# EAGLE design RDA1846 (EAGLE 7.4.0)

## Sheet 1 of 2
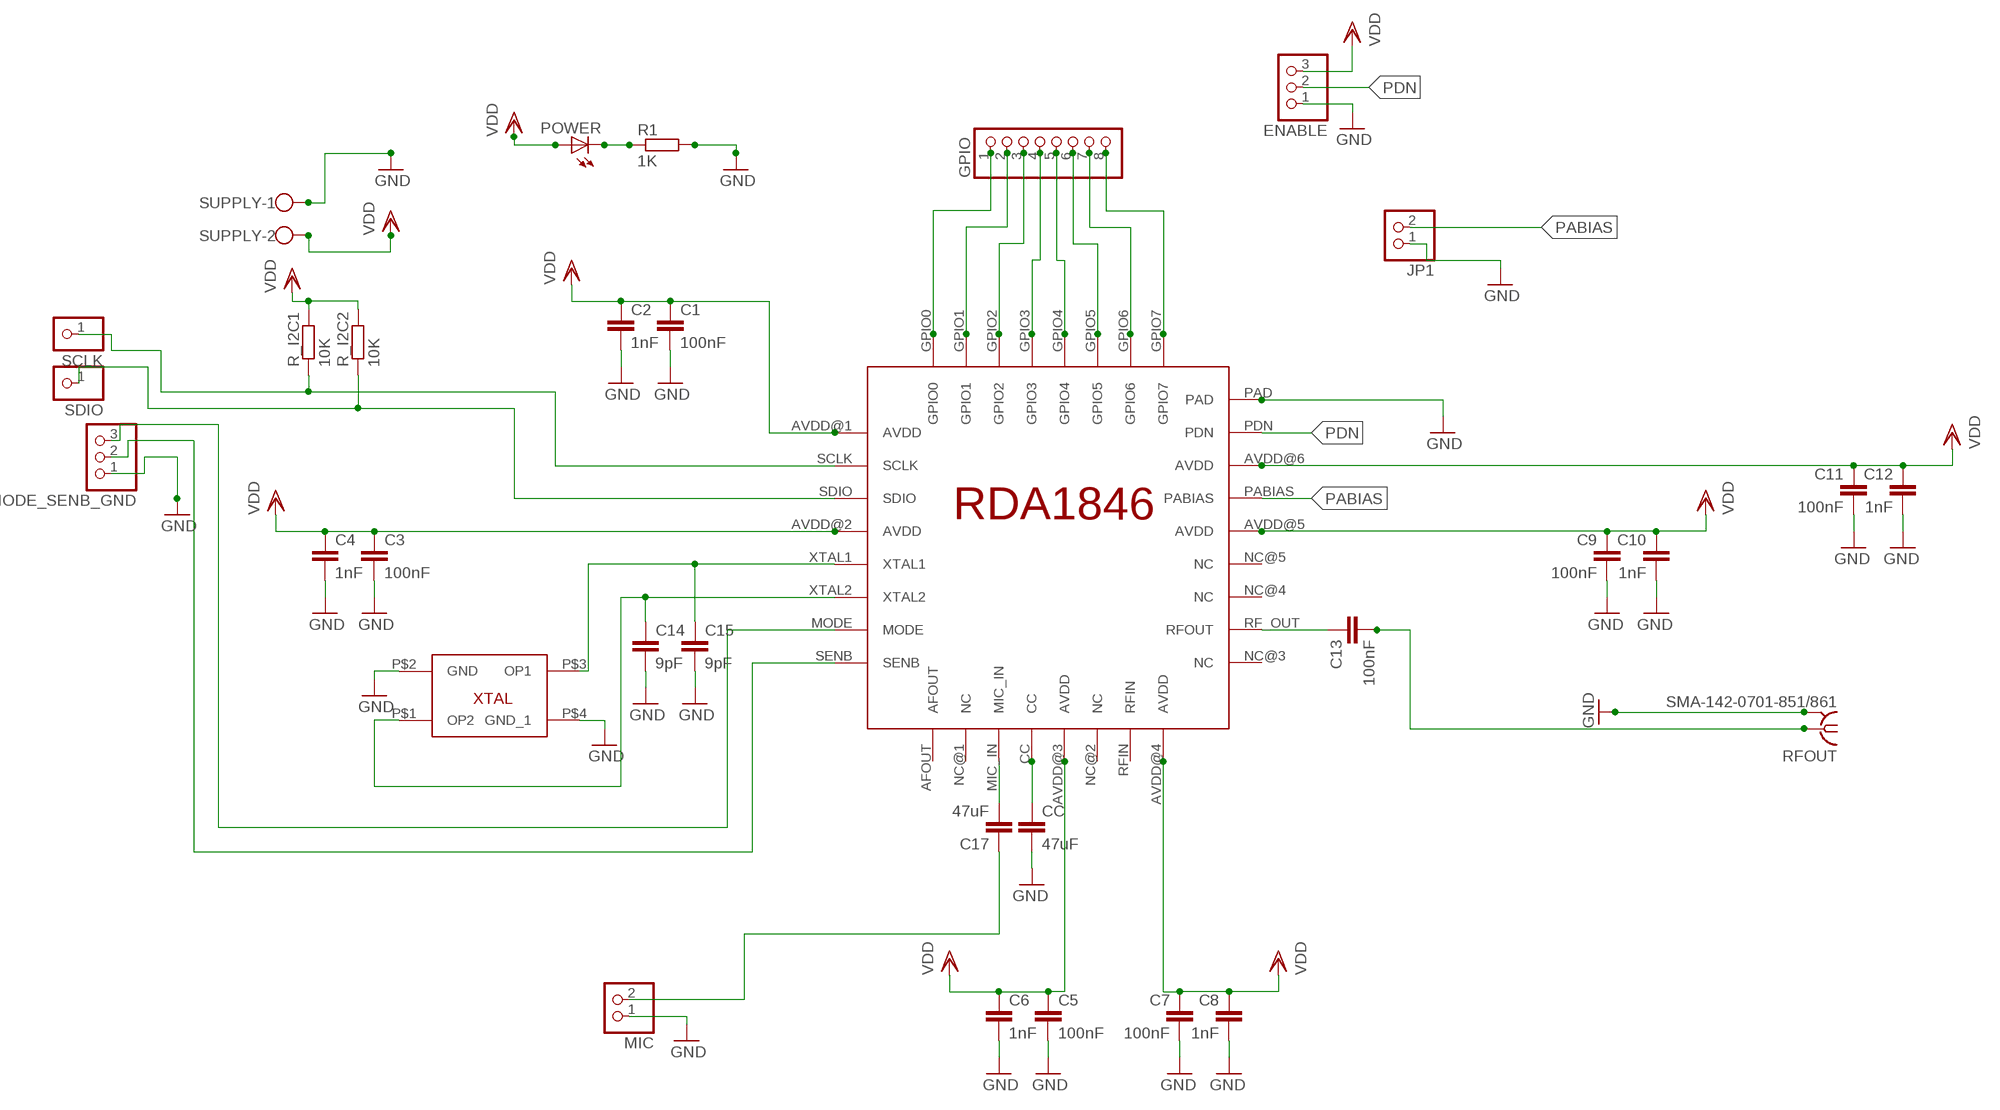
[diagram p0: schematic, sheet 1]

### Parts
C1  100nF  C-EUC0805  [C0805]
C2  1nF  C-EUC0805  [C0805]
C3  100nF  C-EUC0805  [C0805]
C4  1nF  C-EUC0805  [C0805]
C5  100nF  C-EUC0805  [C0805]
C6  1nF  C-EUC0805  [C0805]
C7  100nF  C-EUC0805  [C0805]
C8  1nF  C-EUC0805  [C0805]
C9  100nF  C-EUC0805  [C0805]
C10  1nF  C-EUC0805  [C0805]
C11  100nF  C-EUC0805  [C0805]
C12  1nF  C-EUC0805  [C0805]
C13  100nF  C-EUC0805  [C0805]
C14  9pF  C-EUC0805  [C0805]
C15  9pF  C-EUC0805  [C0805]
C17  47uF  C-EUC0805  [C0805]
CC  47uF  C-EUC0805  [C0805]
ENABLE  PINHD-1X3  [1X03]
GPIO  PINHD-1X8CLEANBIG  [1X08-CLEANBIG]
JP1  PINHD-1X2  [1X02]
MIC  PINHD-1X2  [1X02]
MODE_SENB_GND  PINHD-1X3  [1X03]
POWER  LEDCHIPLED_1206  [CHIPLED_1206]
R1  1K  R-EU_R0805  [R0805]
R_I2C1  10K  R-EU_R0805  [R0805]
R_I2C2  10K  R-EU_R0805  [R0805]
RFOUT  SMA-142-0701-851/861  [J502-ND-142-0701-851/861]
SCLK  PINHD-1X1  [1X01]
SDIO  PINHD-1X1  [1X01]
SUPPLY  W237-102  [W237-102]
U$1  RDA1846  [32_PIN_QFN]
U$2  CRYSTAL_FA_128  [FA_128]

### Nets
GND: C1.2 C2.2 C3.2 C4.2 C5.2 C6.2 C7.2 C8.2 C9.2 C10.2 C11.2 C12.2 C14.2 C15.2 CC.2 ENABLE.1 JP1.1 MIC.1 MODE_SENB_GND.1 R1.2 RFOUT.G@1 RFOUT.G@2 RFOUT.G@3 RFOUT.G@4 SUPPLY.1 U$1.PAD U$2.P$2(GND) U$2.P$4(GND_1) ; also sheet 2
MODE: MODE_SENB_GND.3 U$1.MODE
N$1: GPIO.1 U$1.GPIO0
N$2: GPIO.8 U$1.GPIO7
N$3: GPIO.2 U$1.GPIO1
N$4: GPIO.7 U$1.GPIO6
N$5: GPIO.3 U$1.GPIO2
N$6: GPIO.6 U$1.GPIO5
N$7: GPIO.4 U$1.GPIO3
N$8: GPIO.5 U$1.GPIO4
N$9: POWER.C R1.1
N$10: CC.1 U$1.CC
N$11: C13.1 U$1.RF_OUT(RFOUT)
N$12: C13.2 RFOUT.1
N$13: C15.1 U$1.XTAL1 U$2.P$3(OP1)
N$14: C14.1 U$1.XTAL2 U$2.P$1(OP2)
N$16: C17.2 U$1.MIC_IN
N$18: C17.1 MIC.2
PABIAS: JP1.2 U$1.PABIAS
PDN: ENABLE.2 U$1.PDN
SCLK: R_I2C1.1 SCLK.1 U$1.SCLK
SDIO: R_I2C2.1 SDIO.1 U$1.SDIO
SENB: MODE_SENB_GND.2 U$1.SENB
VDD: C1.1 C2.1 C3.1 C4.1 C5.1 C6.1 C7.1 C8.1 C9.1 C10.1 C11.1 C12.1 ENABLE.3 POWER.A R_I2C1.2 R_I2C2.2 SUPPLY.2 U$1.AVDD@1(AVDD) U$1.AVDD@2(AVDD) U$1.AVDD@3(AVDD) U$1.AVDD@4(AVDD) U$1.AVDD@5(AVDD) U$1.AVDD@6(AVDD)
Unconnected: U$1.AFOUT U$1.NC@1(NC) U$1.NC@2(NC) U$1.NC@3(NC) U$1.NC@4(NC) U$1.NC@5(NC) U$1.RFIN

## Sheet 2 of 2
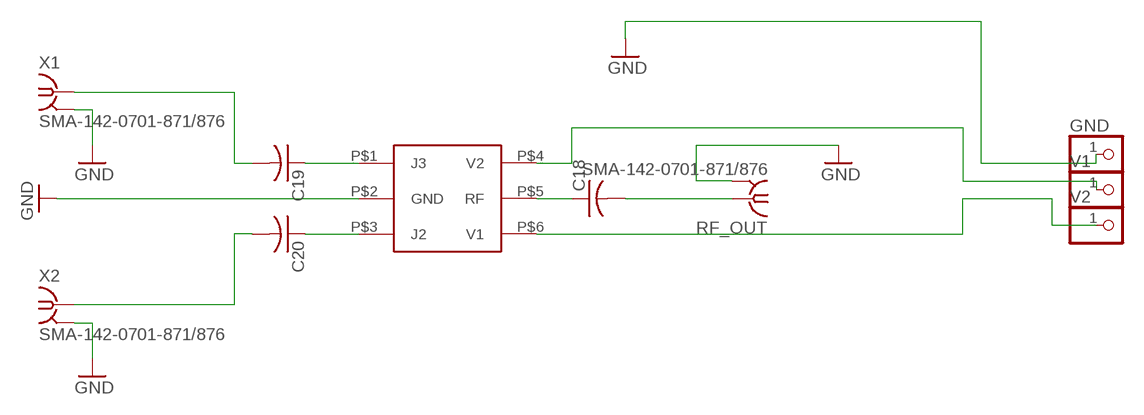
[diagram p1: schematic, sheet 2]

### Parts
C18  C-USC1206  [C1206]
C19  C-USC1206  [C1206]
C20  C-USC1206  [C1206]
GND  PINHD-1X1  [1X01]
RF_OUT  SMA-142-0701-871/876  [J502-ND-142-0701-871/876]
U$3  RF_SWITCH  [SC90]
V1  PINHD-1X1  [1X01]
V2  PINHD-1X1  [1X01]
X1  SMA-142-0701-871/876  [J502-ND-142-0701-871/876]
X2  SMA-142-0701-871/876  [J502-ND-142-0701-871/876]

### Nets
GND: GND.1 RF_OUT.G@1 RF_OUT.G@2 RF_OUT.G@3 RF_OUT.G@4 U$3.P$2(GND) X1.G@1 X1.G@2 X1.G@3 X1.G@4 X2.G@1 X2.G@2 X2.G@3 X2.G@4 ; also sheet 1
N$20: C19.2 X1.1
N$21: C19.1 U$3.P$1(J3)
N$22: C20.1 U$3.P$3(J2)
N$23: C20.2 X2.1
N$24: C18.1 U$3.P$5(RF)
N$25: C18.2 RF_OUT.1
N$26: U$3.P$4(V2) V1.1
N$27: U$3.P$6(V1) V2.1

## Library data of the parts
C1-C15 C17 CC = rcl:C-EU: CAPACITOR, European symbol
C18-C20 = rcl:C-US: CAPACITOR, American symbol
ENABLE MODE_SENB_GND = pinhead:PINHD-1X3: PIN HEADER
GND V1 V2 = pinhead:PINHD-1X1: PIN HEADER
GPIO = adafruit:PINHD-1X8: PIN HEADER
JP1 MIC = pinhead:PINHD-1X2: PIN HEADER
POWER = adafruit:LED: LED OSRAM: - CHIPLED LG R971, LG N971, LY N971, LG Q971, LY Q971, LO R971, LY R971 LH N974, LH R974 LS Q976, LO Q976, LY Q976 LO Q996 - Hyper CHIPLED LW Q18S LB Q993, LB Q99A, LB R99A - SideLED LS A670, LO A670, LY A670, LG A670, LP A670 LB A673, LV A673, LT A673, LW A673 LH A674 LY A675 LS A676, LA A676, LO A676, LY A676, LW A676 LS A679, LY A679, LG A679 - Hyper Micro SIDELED® LS Y876, LA Y876, LO Y876, LY Y876 LT Y87S - SmartLED LW L88C, LW L88S LB L89C, LB L89S, LG L890 LS L89K, LO L89K, LY L89K LS L896, LA L896, LO L896, LY L896 - TOPLED LS T670, LO T670, LY T670, LG T670, LP T670 LSG T670, LSP T670, LSY T670, LOP T670, LYG T670 LG T671, LOG T671, LSG T671 LB T673, LV T673, LT T673, LW T673 LH T674 LS T676, LA T676, LO T676, LY T676, LB T676, LH T676, LSB T676, LW T676 LB T67C, LV T67C, LT T67C, LS T67K, LO T67K, LY T67K, LW E67C LS E67B, LA E67B, LO E67B, LY E67B, LB E67C, LV E67C, LT E67C LW T67C LS T679, LY T679, LG T679 LS T770, LO T770, LY T770, LG T770, LP T770 LB T773, LV T773, LT T773, LW T773 LH T774 LS E675, LA E675, LY E675, LS T675 LS T776, LA T776, LO T776, LY T776, LB T776 LHGB T686 LT T68C, LB T68C - Hyper Mini TOPLED® LB M676 - Mini TOPLED Santana® LG M470 LS M47K, LO M47K, LY M47K Source: http://www.osram.convergy.de/
R1 R_I2C1 R_I2C2 = rcl:R-EU_: RESISTOR, European symbol
RF_OUT X1 X2 = con-coax:SMA-: SMA 50 Ohm End Launch Jack Receptacle - Round Contact Johnson Components Source: www.johnsoncomponents.com .. J502-ND.pdf; MF: JOHNSON COMPONENTS; MPN: 142-0701-871; OC_FARNELL: 1339835; OC_NEWARK: 91B6105
RFOUT = con-coax:SMA-: SMA 50 Ohm End Launch Jack Receptacle - Round Contact Johnson Components Source: www.johnsoncomponents.com .. J502-ND.pdf; MF: JOHNSON COMPONENTS; MPN: 142-0701-851; OC_FARNELL: 1019325; OC_NEWARK: 99F6798
SCLK SDIO = adafruit:PINHD-1X1: Pin header 1x1 for 0.1" spacing With round pins
SUPPLY = con-wago-500:W237-102: WAGO SCREW CLAMP; MPN: 237-102; OC_FARNELL: unknown; OC_NEWARK: 70K9898
U$1 = RDA1846:RDA1846
U$2 = FA_128:CRYSTAL_FA_128
U$3 = RF_SWITCH:RF_SWITCH

## Board
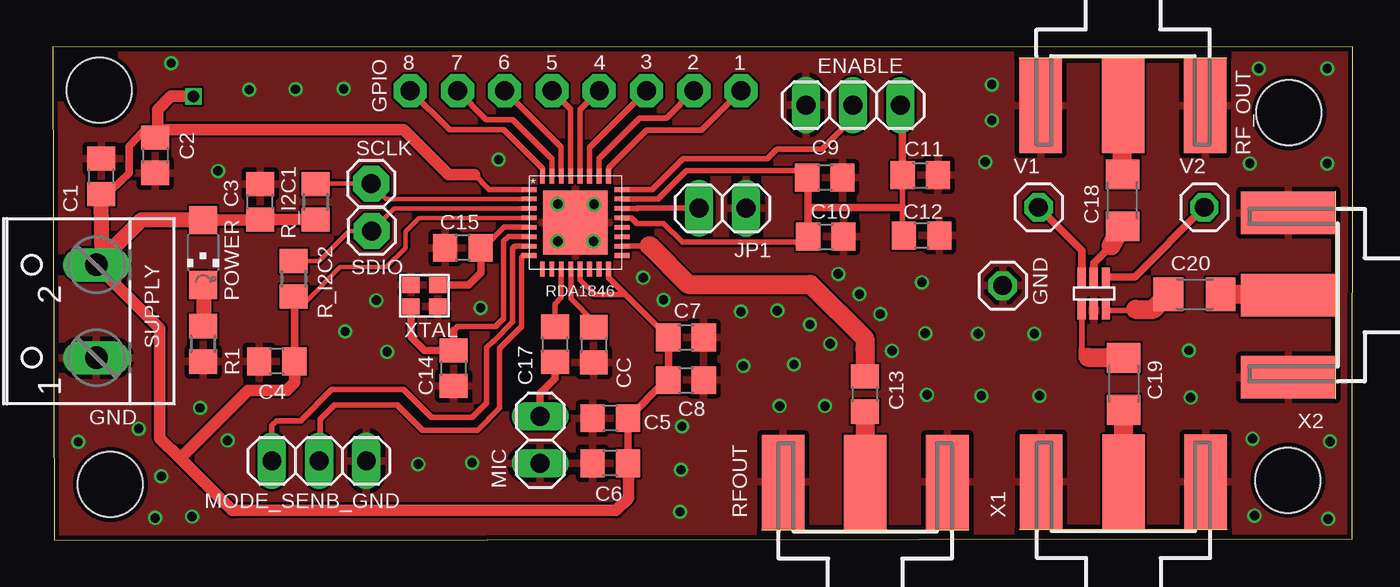
[diagram p2: board, top side]
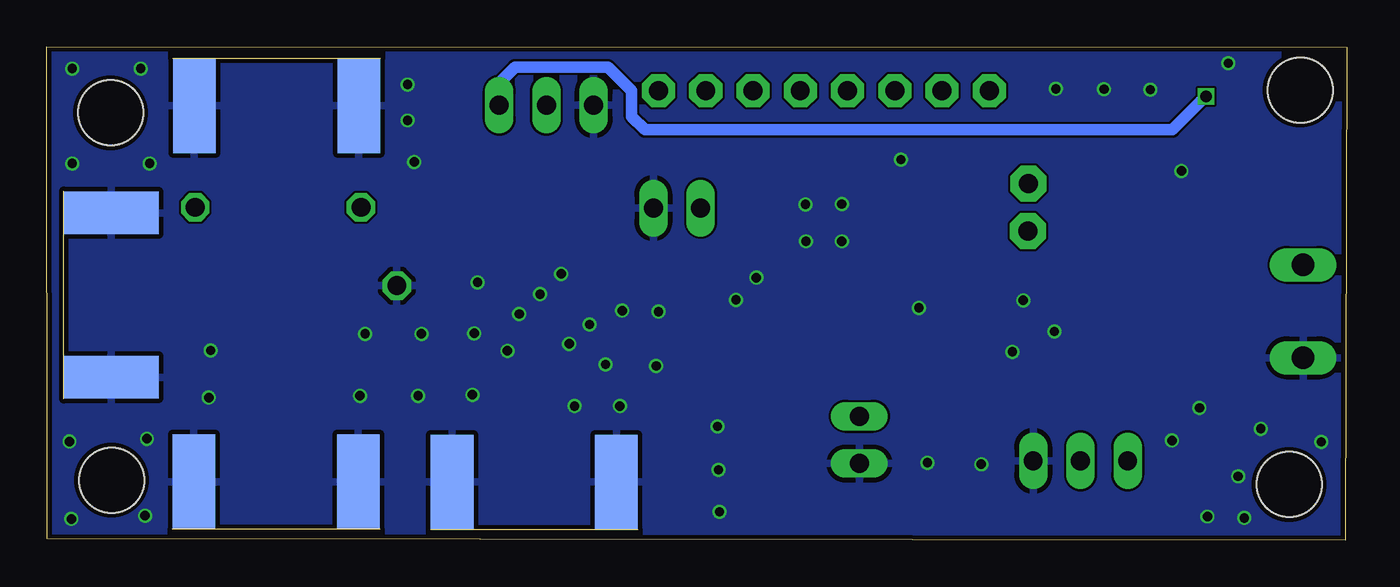
[diagram p3: board, bottom side, seen from below]

Size 69.92 x 26.56 mm. Coordinates in mm from the lower left corner, seen from the top.
Outline: 0.08,0 69.87,0.08 69.92,26.56 0,26.51 0.08,0
Copper layers (1*16): Top 0.035mm / dielectric 1.5mm / Bottom 0.035mm
Design rules "PCB_DRC_check": minimum track width 0.1mm, minimum drill 0.2mm, track to track 0.12mm, track to pad 0.12mm, pad to pad 0.12mm, via to via 0.35mm, smd to smd 0.23mm, copper to edge 0.25mm, drill to drill 0.2mm, minimum pad ring 6mil, minimum via ring 4mil, stop-mask expansion 0.05mm, vias tented up to drill 0mil, thermal gap 10mil
Holes 3.5 mm at 2.51,24.21 3.1,3 66.42,3.23 66.47,22.99

### Footprints (pad centres in the part's own frame; a part is rotated, then mirrored left to right if it is on the bottom)
C0805 = smd 1.3 x 1.5: 1 -0.95,0; 2 0.95,0
C1206 = smd 1.6 x 1.8: 1 -1.4,0; 2 1.4,0
1X03 = drill 1.016 long: 1 -2.54,0; 2 0,0; 3 2.54,0
1X01 = drill 1.016 octagon: 1 0,0
1X08-CLEANBIG = drill 1.016 pad 1.778 octagon: 1 -8.89,0; 2 -6.35,0; 3 -3.81,0; 4 -1.27,0; 5 1.27,0; 6 3.81,0; 7 6.35,0; 8 8.89,0
1X02 = drill 1.016 long: 1 -1.27,0; 2 1.27,0
CHIPLED_1206 = smd 1.5 x 1.5: A 0,-1.75; C 0,1.75
R0805 = smd 1.3 x 1.5: 1 -0.95,0; 2 0.95,0
J502-ND-142-0701-871/876 = smd 5.08 x 2.286: 1 2.565,0; G@1 2.565,4.42; G@2 2.565,-4.42 | smd 5.08 x 2.286 bottom: G@3 2.565,4.42; G@4 2.565,-4.42
J502-ND-142-0701-851/861 = smd 5.08 x 2.286: 1 2.565,0; G@1 2.565,4.42; G@2 2.565,-4.42 | smd 5.08 x 2.286 bottom: G@3 2.565,4.42; G@4 2.565,-4.42
1X01' = drill 1.016 pad 1.93 octagon: 1 0,0
W237-102 = drill 1.194 long: 1 -2.5,-1.27; 2 2.5,-1.27
32_PIN_QFN = smd 0.254 x 0.813: AFOUT -1.778,-2.502; AVDD@3 0.254,-2.502; AVDD@4 1.778,-2.502; CC -0.254,-2.502; GPIO0 -1.778,2.502; GPIO1 -1.27,2.502; GPIO2 -0.762,2.502; GPIO3 -0.254,2.502; GPIO4 0.254,2.502; GPIO5 0.762,2.502; GPIO6 1.27,2.502; GPIO7 1.778,2.502; MIC_IN -0.762,-2.502; NC@1 -1.27,-2.502; NC@2 0.762,-2.502; RFIN 1.27,-2.502 | smd 0.813 x 0.254: AVDD@1 -2.502,1.778; AVDD@2 -2.502,0.254; AVDD@5 2.502,0.254; AVDD@6 2.502,1.27; MODE -2.502,-1.27; NC@3 2.502,-1.778; NC@4 2.502,-0.762; NC@5 2.502,-0.254; PABIAS 2.502,0.762; PDN 2.502,1.778; RF_OUT 2.502,-1.27; SCLK -2.502,1.27; SDIO -2.502,0.762; SENB -2.502,-1.778; XTAL1 -2.502,-0.254; XTAL2 -2.502,-0.762 | smd 3.454 x 3.454: PAD 0,0
FA_128 = smd 0.95 x 0.85: P$1 0,0; P$2 0,1.15; P$3 1.45,1.15; P$4 1.45,0
SC90 = smd 0.45 x 1: P$1 0,0; P$2 0.65,0; P$3 1.3,0; P$4 0,1.8; P$5 0.65,1.8; P$6 1.3,1.8

### Placement (x,y rotation side)
C1  2.62,19.57 90 top
C2  5.52,20.71 270 top
C3  11.16,18.2 90 top
C4  12.05,9.62 180 top
C5  29.98,6.56 180 top
C6  29.98,4.14 180 top
C7  34.05,10.91 0 top
C8  34.05,8.61 0 top
C9  41.52,19.51 0 top
C10  41.57,16.32 0 top
C11  46.65,19.64 0 top
C12  46.73,16.4 0 top
C13  43.67,7.86 270 top
C14  21.55,9.26 270 top
C15  22.06,15.73 180 top
C17  27.02,10.53 90 top
C18  57.52,18.29 90 top
C19  57.58,8.41 270 top
C20  61.39,13.24 0 top
CC  29.09,10.5 270 top
ENABLE  43.04,23.4 0 top
GND  51.08,13.69 0 top
GPIO  28.12,24.18 0 top
JP1  36.02,17.86 180 top
MIC  26.21,5.39 90 top
MODE_SENB_GND  14.33,4.27 180 top
POWER  8.09,15.48 180 top
R1  8.09,10.55 270 top
R_I2C1  14.14,18.2 270 top
R_I2C2  12.95,14.06 270 top
RF_OUT  57.55,25.94 270 top
RFOUT  43.69,0.56 90 top
SCLK  [1X01']  17.12,19.18 0 top
SDIO  [1X01']  17.14,16.64 0 top
SUPPLY  1.08,12.31 90 top
U$1  28.11,17.09 0 top
U$2  19.26,12.57 0 top
U$3  55.33,12.37 0 top
V1  53.01,17.91 0 top
V2  61.93,17.91 0 top
X1  57.57,0.58 90 top
X2  68.99,13.18 180 top

### Tracks (layer width: path | path; a pad name or v marks a point on that pad's centre or on a via)
GND  (via drill 0.5 pad 0.25)
  Top 0.305: U$1.PAD 28.08,17.09 v27.15,18.08
  Bottom 0.305: v23.01,12.5 23.01,12.5 23,12.52
  other vias: 29.11,18.06 27.15,16.08 29.08,16.08 17.98,10.13 6.38,25.65 8.89,19.86 1.37,5.28 4.62,5.99 5.51,1.19 5.84,3.43 7.49,1.27 7.92,7.11 9.4,5.36 10.57,24.23 15.65,24.28 19.66,4.09 22.56,4.17 33.83,6.12 33.78,3.78 33.73,1.52 31.75,14.12 32.84,12.93 37.01,12.29 38.96,12.34 40.72,11.61 41.81,10.57 42.24,14.33 43.38,13.23 45.14,10.19 44.5,12.17 46.74,13.87 46.91,11.13 47.02,7.82 49.76,11.1 49.94,7.77 53.06,7.77 52.78,11.1 37.13,9.37 39.85,9.45 39.09,7.21 41.53,7.21 23.98,20.47 50.5,24.51 50.5,22.58 50.14,20.35 13.06,24.26 61.09,10.21 61.19,7.67 64.52,5.46 68.68,5.31 64.62,1.32 68.58,1.14 68.53,25.37 64.85,25.37 64.36,20.27 68.53,20.27 17.4,12.9 15.72,11.23
  pour Top: -5.38,37.69 79.55,37.95 80.06,-13.08 -4.88,-13.34
  pour Bottom: -2.97,31.57 75.77,32.03 75.77,-8.66 -2.97,-9.12
MODE
  Top 0.305: U$1.MODE 24.86,15.82 24.74,15.7 24.74,11.73 23.7,10.69 23.67,10.69 23.34,10.36 23.34,7.39 22.55,6.6 20.37,6.6 18.87,8.1 15.01,8.1 13.33,6.43 12.04,6.43 11.79,6.17 MODE_SENB_GND.3 11.76,4.29
N$1
  Top 0.305: U$1.GPIO0 26.33,20 24.26,22.07 21.33,22.07 GPIO.1
N$2
  Top 0.305: U$1.GPIO7 29.89,20 31.93,22.05 34.88,22.05 GPIO.8
N$3
  Top 0.305: U$1.GPIO1 26.84,20.51 24.71,22.63 23.32,22.63 GPIO.2
N$4
  Top 0.305: U$1.GPIO6 29.38,20.54 31.55,22.71 33,22.71 GPIO.7
N$5
  Top 0.305: U$1.GPIO2 27.35,21.14 GPIO.3
N$6
  Top 0.305: U$1.GPIO5 28.87,21.12 GPIO.6
N$7
  Top 0.305: U$1.GPIO3 27.85,23.17 GPIO.4
N$8
  Top 0.305: U$1.GPIO4 28.36,23.15 GPIO.5
N$9
  Top 0.813: POWER.C 8.14,11.61 R1.1
N$10
  Top 0.305: CC.1 29.09,11.77 27.86,13 U$1.CC
N$11
  Top 0.305: U$1.RF_OUT 32.07,15.82 32.08,15.82
  Top 1.016: 32.08,15.82 32.11,15.82 34.16,13.77 40.74,13.77 43.66,10.85 43.66,10.29 C13.1
N$12
  Top 1.016: C13.2 43.67,4.03 43.76,3.94 43.76,2.72 RFOUT.1
N$13
  Top 0.305: C15.1 23.17,15.73 24.28,16.84 U$1.XTAL1
  Top 0.406: U$2.P$3 22.36,13.72 23.04,14.4 23.04,15.7 C15.1
N$14
  Top 0.305: U$1.XTAL2 24.5,16.32 24.26,16.08 24.26,11.94 23.83,11.51 21.77,11.51 21.55,11.28
  Top 0.406: 21.55,11.28 C14.1 19.99,10.21 19.26,10.94 U$2.P$1
N$16
  Top 0.305: U$1.MIC_IN 27.35,13.04 27,12.7 27,11.5 C17.2
N$18
  Top 0.406: C17.1 27.02,8.71 26.21,7.9 MIC.2
N$20
  Top 1.016: C19.2 X1.1
N$21
  Top 0.305: U$3.P$1 55.33,10.18 55.68,9.83
  Top 1.016: 55.68,9.83 57.56,9.83 C19.1
N$22
  Top 0.305: U$3.P$3 58.16,12.37 58.22,12.42
  Top 1.016: 58.22,12.42 59.17,12.42 C20.1
N$23
  Top 1.016: C20.2 66.91,13.23 X2.1
N$24
  Top 0.406: U$3.P$5 55.98,14.9 56.92,15.85
  Top 1.016: 56.92,15.85 C18.1
N$25
  Top 1.016: C18.2 57.54,23.7 RF_OUT.1
N$26
  Top 0.406: U$3.P$4 55.33,15.59 V1.1
N$27
  Top 0.406: U$3.P$6 58.18,14.17 V2.1
PABIAS
  Top 0.305: U$1.PABIAS 31.44,17.85 31.45,17.86 JP1.2
PDN
  Top 0.305: U$1.PDN 32.23,18.86 33.88,20.52 38.43,20.52 38.94,21.03 41.35,21.03 43.08,22.76 43.03,23.31 ENABLE.2
SCLK
  Top 0.254: U$1.SCLK 17.94,18.36 SCLK.1 14.16,19.18 R_I2C1.1
SDIO
  Top 0.254: U$1.SDIO 18.36,17.85 SDIO.1 15.95,16.64 14.33,15.01 R_I2C2.1
SENB
  Top 0.305: U$1.SENB 25.32,15.31 25.22,15.21 25.22,11.51 24.03,10.31 24.03,7.11 22.84,5.92 19.89,5.92 18.52,7.29 15.16,7.29 14.38,6.5 14.38,4.32 MODE_SENB_GND.2
VDD  (via drill 0.6)
  Top 0: U$1.AVDD@5 31.14,17.34 31.14,17.3 31.37,17.3 31.37,17.09 32.77,17.09 32.82,17.04 33.86,16 40.46,16 40.59,16.13 40.59,19.58 40.51,19.66 40.51,18.03 40.61,17.93 45.57,17.93 45.62,17.88 45.7,17.88 45.72,17.91 45.72,20.02 45.7,20.04 45.7,23.29 | U$1.AVDD@4 29.89,14.21 29.87,14.2 29.87,14.15 30.73,13.28 30.76,13.28 33.2,10.85 33.2,8.64 33.12,8.56 32.84,8.56 30.91,6.63 30.91,4.04 30.96,3.99 | 25.59,18.85 23.5,18.85 22.63,19.71 21.21,19.71 18.85,22.07 5.59,22.07 5.54,22.02
  Top 0.254: U$1.AVDD@2 19.7,17.34 18.97,16.61 18.97,15.72 17.93,14.68 15.47,14.68 13.66,12.88 13.19,12.88 R_I2C2.2
  Top 0.305: 25.59,18.85 U$1.AVDD@1 23.47,18.87 22.68,19.66 | U$1.AVDD@5 31.12,17.34 31.37,17.09 31.42,17.04 32.82,17.04 32.84,17.04 33.86,16.03 40.32,16.03 C10.1 | 40.62,19.46 C9.1 40.2,19.89 34.09,19.89 32.55,18.36 U$1.AVDD@6 | C11.1 45.7,17.91 45.7,16.47 C12.1 | U$1.AVDD@3 28.36,14.01 29.16,13.21 30.8,13.21 | 30.8,13.21 C7.1 | U$1.AVDD@4 29.89,14.13 30.8,13.21
  Top 0.406: 5.5,21.68 C2.1 | C7.1 C8.1 32.97,8.61 C5.1 C6.1 | 40.62,17.89 C10.1 | 40.62,19.46 40.62,17.89 | 40.62,17.89 40.61,17.88 45.62,17.88 45.68,17.88 45.7,17.91 | C11.1 45.7,23.27 ENABLE.3 | R_I2C2.2 13,13.07 C4.1 13,9.38 13,9.37 | 5.54,22.02 4.9,22.02 4.12,21.21 4.12,19.76 2.59,18.29
  Top 0.61: POWER.A 11.13,17.23 C3.1 R_I2C1.2 | 22.68,19.66 21.29,19.66 18.87,22.07 18.85,22.07 5.94,22.07 C2.1 5.64,21.78 5.64,23.16 6.35,23.88 v7.57,23.88 | 30.96,3.99 30.96,2.26 30.3,1.6 9.65,1.6 6.86,4.39 | 6.86,4.39 5.77,5.49 5.77,11.4 SUPPLY.2 | 13,9.78 13,9.37 13,8.48 12.57,8.05 10.52,8.05 6.86,4.39
  Top 0.813: C1.1 2.59,18.29 2.64,15.1 SUPPLY.2 4.77,17.23 POWER.A
  Bottom 0.61: v7.57,23.88 9.37,22.07 37.74,22.07 38.46,22.78 38.46,24.18 39.73,25.45 44.73,25.45 45.57,24.61 ENABLE.3
(copper drawn outside any net)
  shapes: Top area x1

### Text on the board
tNames: 8 | 7 | 6 | 5 | 4 | 3 | 2 | 1 | GND